# EasyEDA Pro project PCB_power-distribution.eprj

# Schematic power distribution
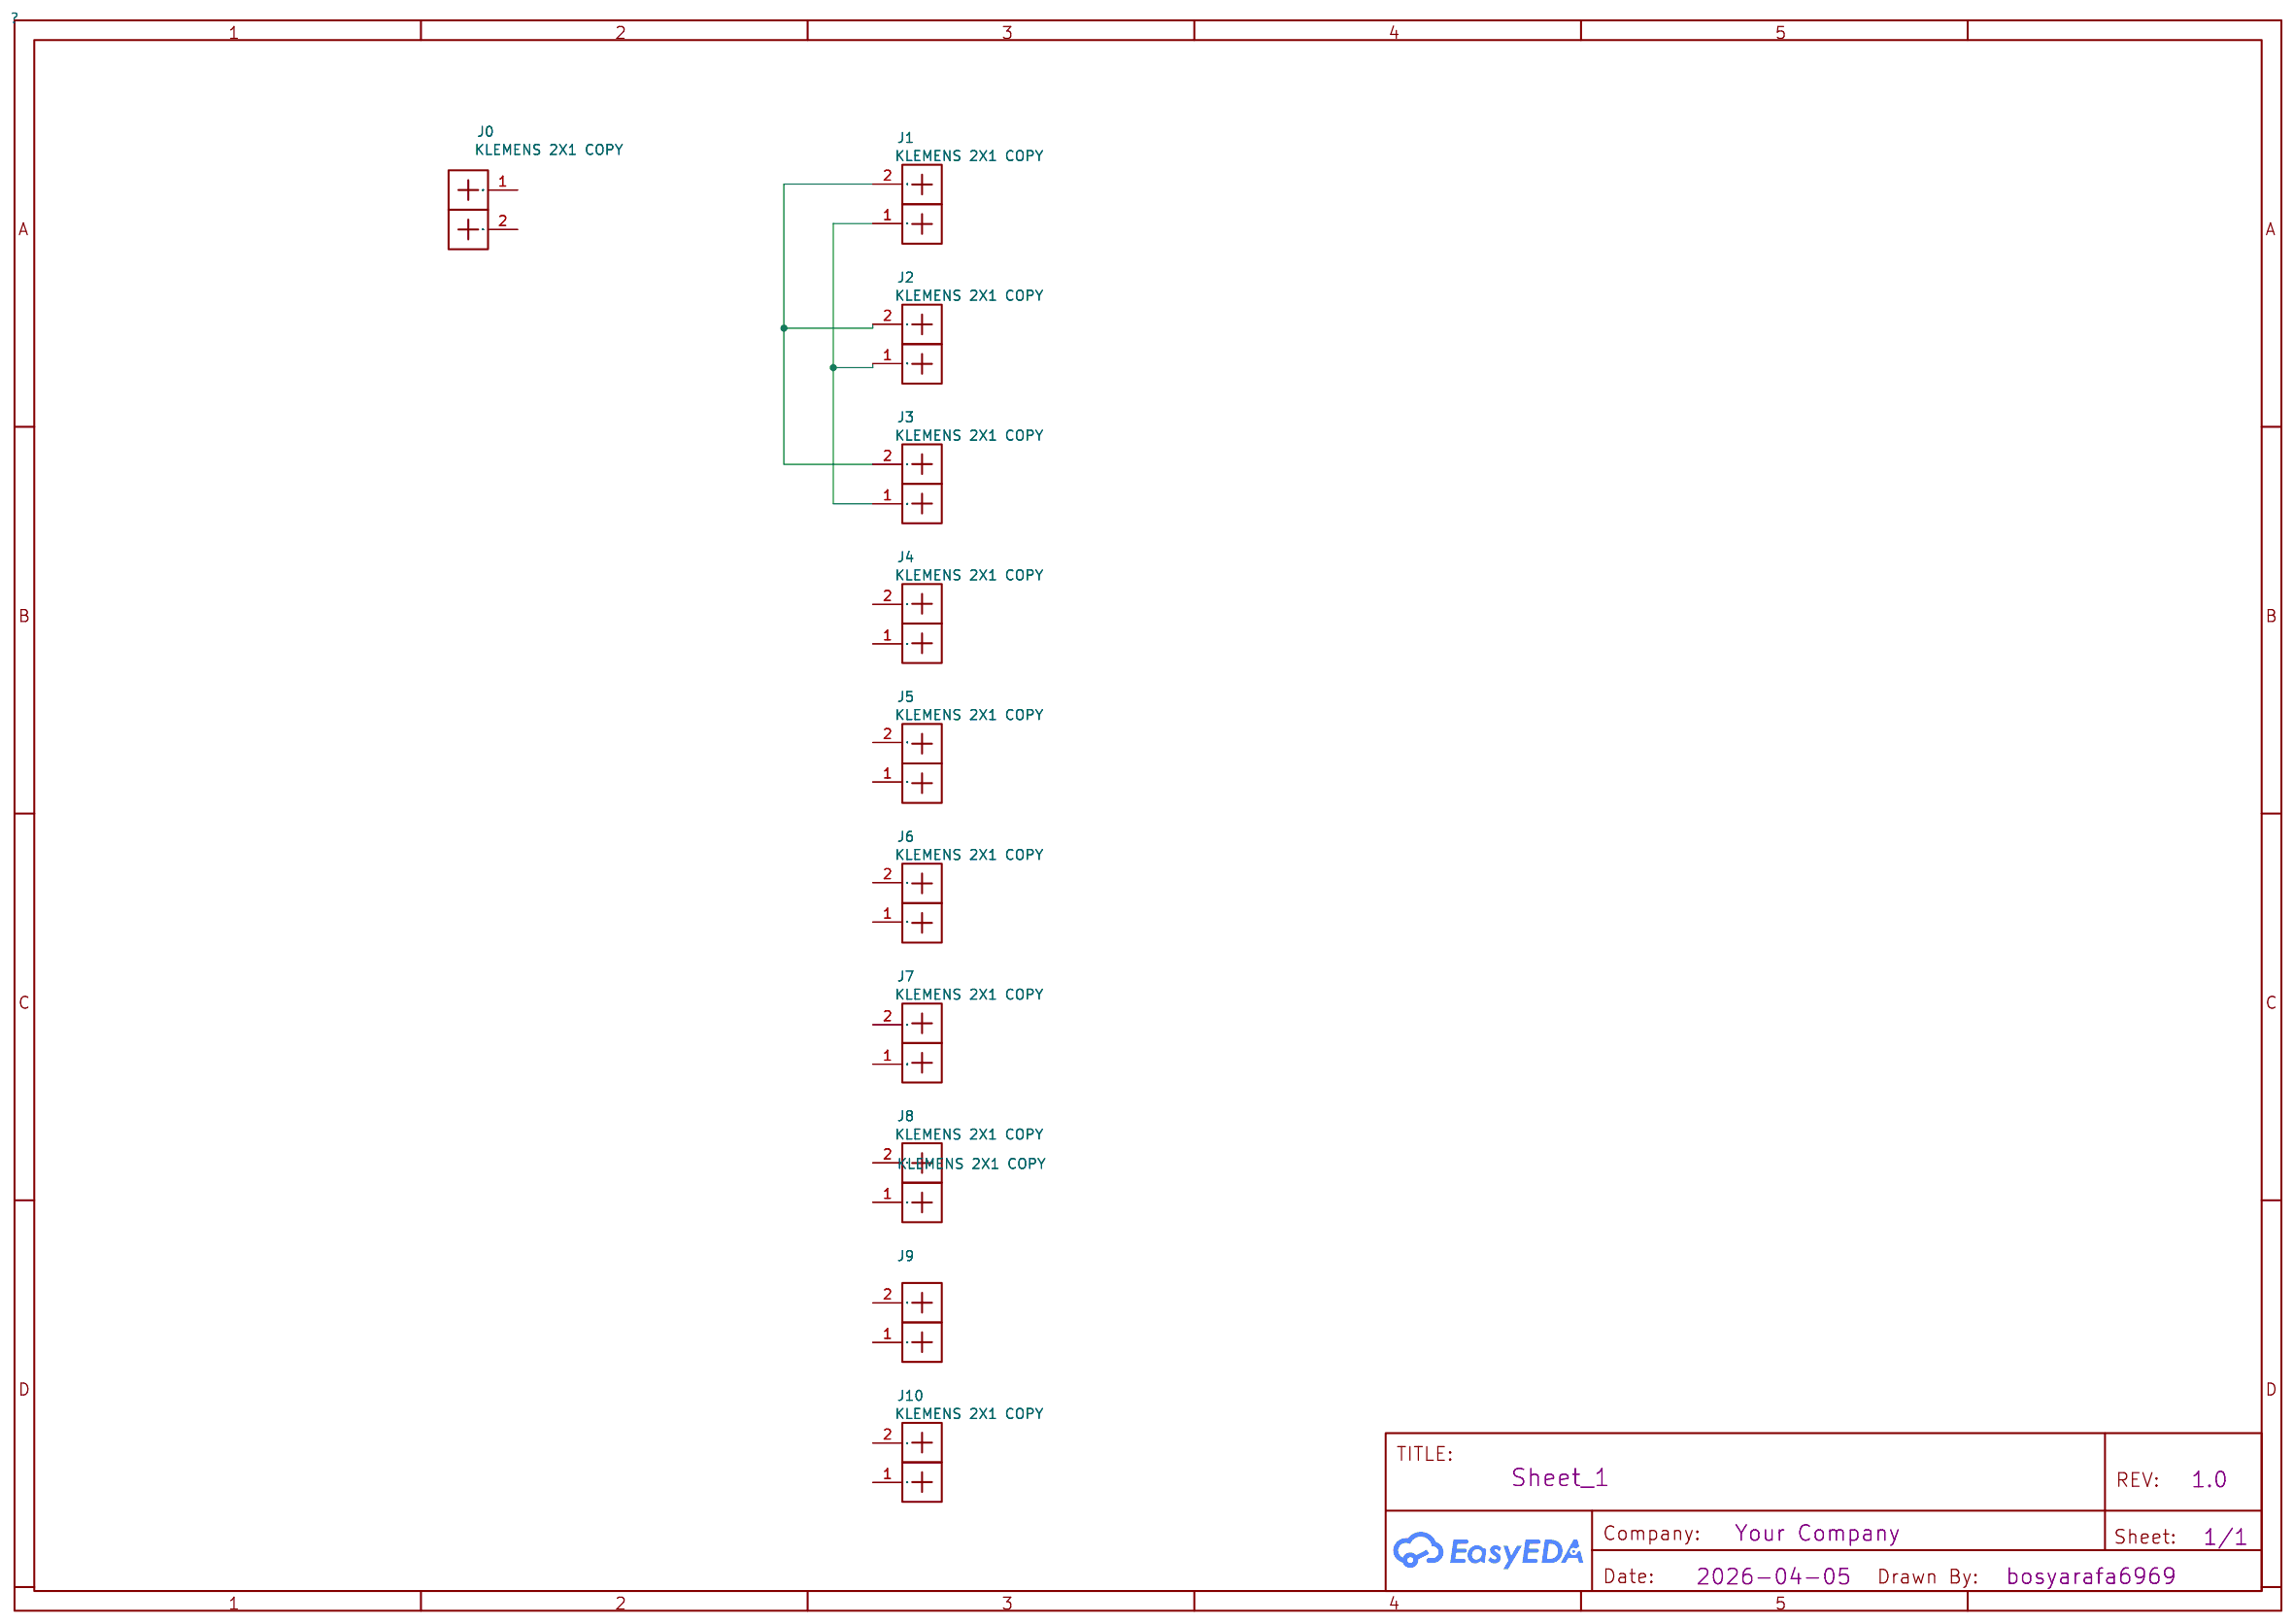
[diagram p0: schematic sheet]

## Parts
J0  KLEMENS 2X1 COPY  [TERMINALBLOCK_METZCONNECT:TERMINALBLOCK_METZCONNECT_360271_1X01_HORIZONTAL_SCREWM3.0_BOXED]
J1  KLEMENS 2X1 COPY  [TERMINALBLOCK_METZCONNECT:TERMINALBLOCK_METZCONNECT_360271_1X01_HORIZONTAL_SCREWM3.0_BOXED]
J2  KLEMENS 2X1 COPY  [TERMINALBLOCK_METZCONNECT:TERMINALBLOCK_METZCONNECT_360271_1X01_HORIZONTAL_SCREWM3.0_BOXED]
J3  KLEMENS 2X1 COPY  [TERMINALBLOCK_METZCONNECT:TERMINALBLOCK_METZCONNECT_360271_1X01_HORIZONTAL_SCREWM3.0_BOXED]
J4  KLEMENS 2X1 COPY  [TERMINALBLOCK_METZCONNECT:TERMINALBLOCK_METZCONNECT_360271_1X01_HORIZONTAL_SCREWM3.0_BOXED]
J5  KLEMENS 2X1 COPY  [TERMINALBLOCK_METZCONNECT:TERMINALBLOCK_METZCONNECT_360271_1X01_HORIZONTAL_SCREWM3.0_BOXED]
J6  KLEMENS 2X1 COPY  [TERMINALBLOCK_METZCONNECT:TERMINALBLOCK_METZCONNECT_360271_1X01_HORIZONTAL_SCREWM3.0_BOXED]
J7  KLEMENS 2X1 COPY  [TERMINALBLOCK_METZCONNECT:TERMINALBLOCK_METZCONNECT_360271_1X01_HORIZONTAL_SCREWM3.0_BOXED]
J8  KLEMENS 2X1 COPY  [TERMINALBLOCK_METZCONNECT:TERMINALBLOCK_METZCONNECT_360271_1X01_HORIZONTAL_SCREWM3.0_BOXED]
J9  KLEMENS 2X1 COPY  [TERMINALBLOCK_METZCONNECT:TERMINALBLOCK_METZCONNECT_360271_1X01_HORIZONTAL_SCREWM3.0_BOXED]
J10  KLEMENS 2X1 COPY  [TERMINALBLOCK_METZCONNECT:TERMINALBLOCK_METZCONNECT_360271_1X01_HORIZONTAL_SCREWM3.0_BOXED]

## Library data of the parts
J0-J10 = KLEMENS 2X1 COPY: Generic screw terminal, single row, 01x01, script generated (kicad-library-utils/schlib/autogen/connector/); Comment: Connector_Screw_Terminal_01x01; Contributor: fjju1212; spicePre: J

## Nets
Net-(J1-1): J1.1(Gnd) J2.1(Gnd) J3.1(Gnd)
Net-(J1-2): J1.2(Vcc) J2.2(Vcc) J3.2(Vcc)

Not connected (* = marked no-connect by the designer): J0 1(Gnd) 2(Vcc); J4 1(Gnd) 2(Vcc); J5 1(Gnd) 2(Vcc); J6 1(Gnd) 2(Vcc); J7 1(Gnd) 2(Vcc); J8 1(Gnd) 2(Vcc); J9 1(Gnd) 2(Vcc); J10 1(Gnd) 2(Vcc)

# Board PCB_PCB_power-distribution_2026-04-17 (1)
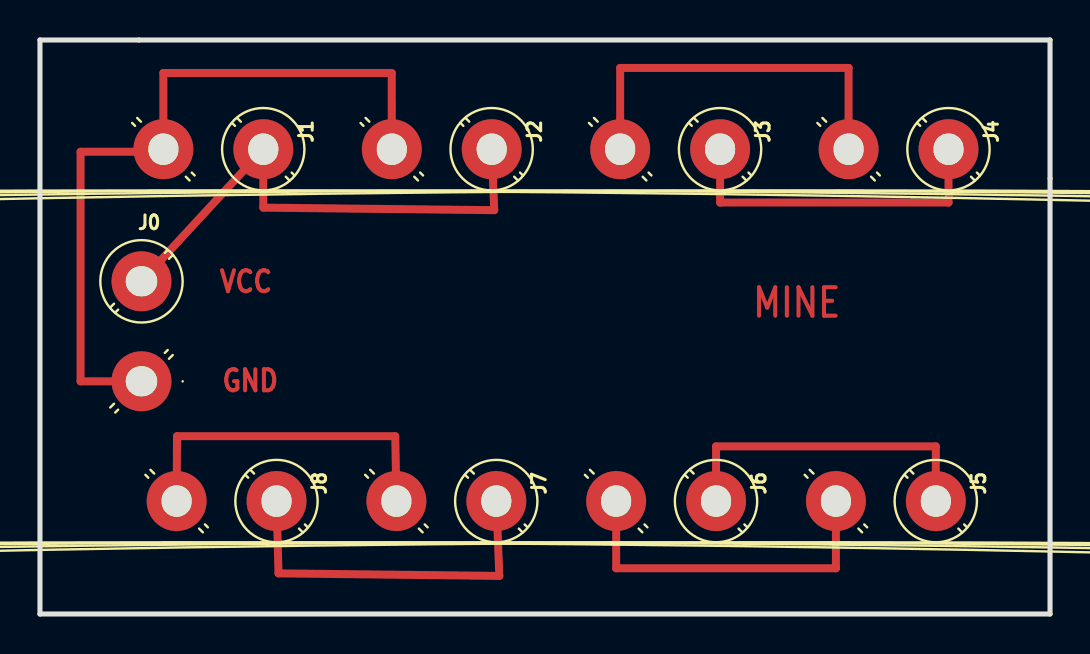
[diagram p1: board, top side]
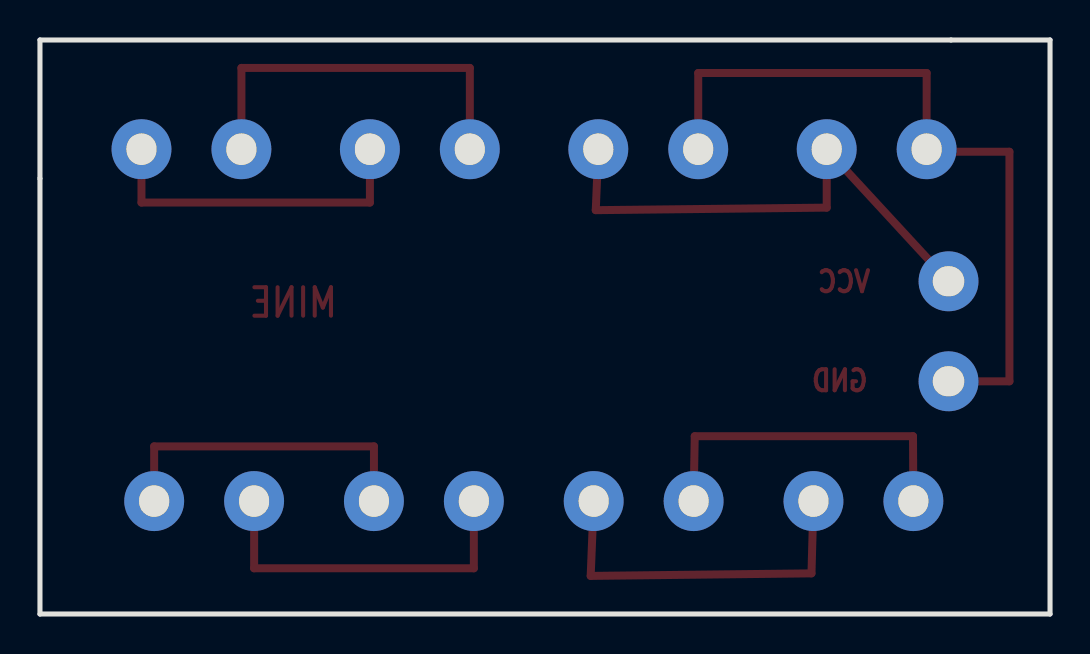
[diagram p2: board, bottom side, seen from below]

Outline 50.55 x 28.7 mm; copper layers: Top Layer, Bottom Layer. Coordinates in mm from the lower left corner of the outline.
Outline path: 0,28.7 50.55,28.7 50.55,0 0,0 0,28.7

## Design rules (mm)
via Default (default): diameter min 0.61, default 0.61, max 100.025; hole min 0.305, default 0.305, max 59.995

## Placement (name value [footprint] x y rotation side)
J0  KLEMENS 2X1 COPY  [TERMINALBLOCK_METZCONNECT:TERMINALBLOCK_METZCONNECT_360271_1X01_HORIZONTAL_SCREWM3.0_BOXED]  5.08 16.64 0 top
J1  KLEMENS 2X1 COPY  [TERMINALBLOCK_METZCONNECT:TERMINALBLOCK_METZCONNECT_360271_1X01_HORIZONTAL_SCREWM3.0_BOXED]  11.18 23.24 270 top
J2  KLEMENS 2X1 COPY  [TERMINALBLOCK_METZCONNECT:TERMINALBLOCK_METZCONNECT_360271_1X01_HORIZONTAL_SCREWM3.0_BOXED]  22.61 23.24 270 top
J3  KLEMENS 2X1 COPY  [TERMINALBLOCK_METZCONNECT:TERMINALBLOCK_METZCONNECT_360271_1X01_HORIZONTAL_SCREWM3.0_BOXED]  34.04 23.24 270 top
J4  KLEMENS 2X1 COPY  [TERMINALBLOCK_METZCONNECT:TERMINALBLOCK_METZCONNECT_360271_1X01_HORIZONTAL_SCREWM3.0_BOXED]  45.47 23.24 270 top
J5  KLEMENS 2X1 COPY  [TERMINALBLOCK_METZCONNECT:TERMINALBLOCK_METZCONNECT_360271_1X01_HORIZONTAL_SCREWM3.0_BOXED]  44.83 5.65 270 top
J6  KLEMENS 2X1 COPY  [TERMINALBLOCK_METZCONNECT:TERMINALBLOCK_METZCONNECT_360271_1X01_HORIZONTAL_SCREWM3.0_BOXED]  33.83 5.65 270 top
J7  KLEMENS 2X1 COPY  [TERMINALBLOCK_METZCONNECT:TERMINALBLOCK_METZCONNECT_360271_1X01_HORIZONTAL_SCREWM3.0_BOXED]  22.84 5.65 270 top
J8  KLEMENS 2X1 COPY  [TERMINALBLOCK_METZCONNECT:TERMINALBLOCK_METZCONNECT_360271_1X01_HORIZONTAL_SCREWM3.0_BOXED]  11.84 5.65 270 top

## Footprints (pads in the part's own frame, mm; a bottom-side part is the same pattern mirrored in y, then rotated)
TERMINALBLOCK_METZCONNECT:TERMINALBLOCK_METZCONNECT_360271_1X01_HORIZONTAL_SCREWM3.0_BOXED
  round 3 hole 1.575x1.5: 1(0,0) 2(0,-5)

## Nets
J1_1: J0.1 J1.1 J2.1
J1_2: J0.2 J1.2 J2.2
J3_1: J7.1 J8.1
J3_2: J7.2 J8.2
J5_1: J5.1 J6.1
J5_2: J5.2 J6.2
J7_1: J3.1 J4.1
J7_2: J3.2 J4.2

## Routing (per net, layer and track width the routed paths; a pad name or vN(x,y) marks a point on that pad's centre or on a via; arc(x,y) is an arc through that point)
J1_1: length 27.4
  Top Layer w0.4: J2.1 22.73,20.19 11.18,20.32 J1.1 ; J1.1 11.78,22.64 ; J1.1 J0.1
J1_2: length 38.5
  Top Layer w0.4: 5.08,11.64 2.03,11.64 2.03,23.11 6.17,23.11 6.17,23.94 ; J2.2 17.6,27.05 6.17,27.05 J1.2
J3_1: length 18.4
  Top Layer w0.4: J7.1 22.99,1.91 11.94,2.03 J8.1
J3_2: length 17.4
  Top Layer w0.4: 6.84,5.65 6.86,8.89 17.78,8.89 J7.2
J5_1: length 16.5
  Top Layer w0.4: 33.83,5.65 33.83,8.38 44.83,8.38 J5.1
J5_2: length 17.7
  Top Layer w0.4: J6.2 28.83,2.29 39.83,2.29 39.83,5.65
J7_1: length 16.8
  Top Layer w0.4: J3.1 34.04,20.57 45.47,20.57 J4.1
J7_2: length 19.6
  Top Layer w0.4: 29.03,23.24 29.03,27.3 40.46,27.3 40.46,23.24

## Text on the board
Top Layer: VCC | GND | MINE
